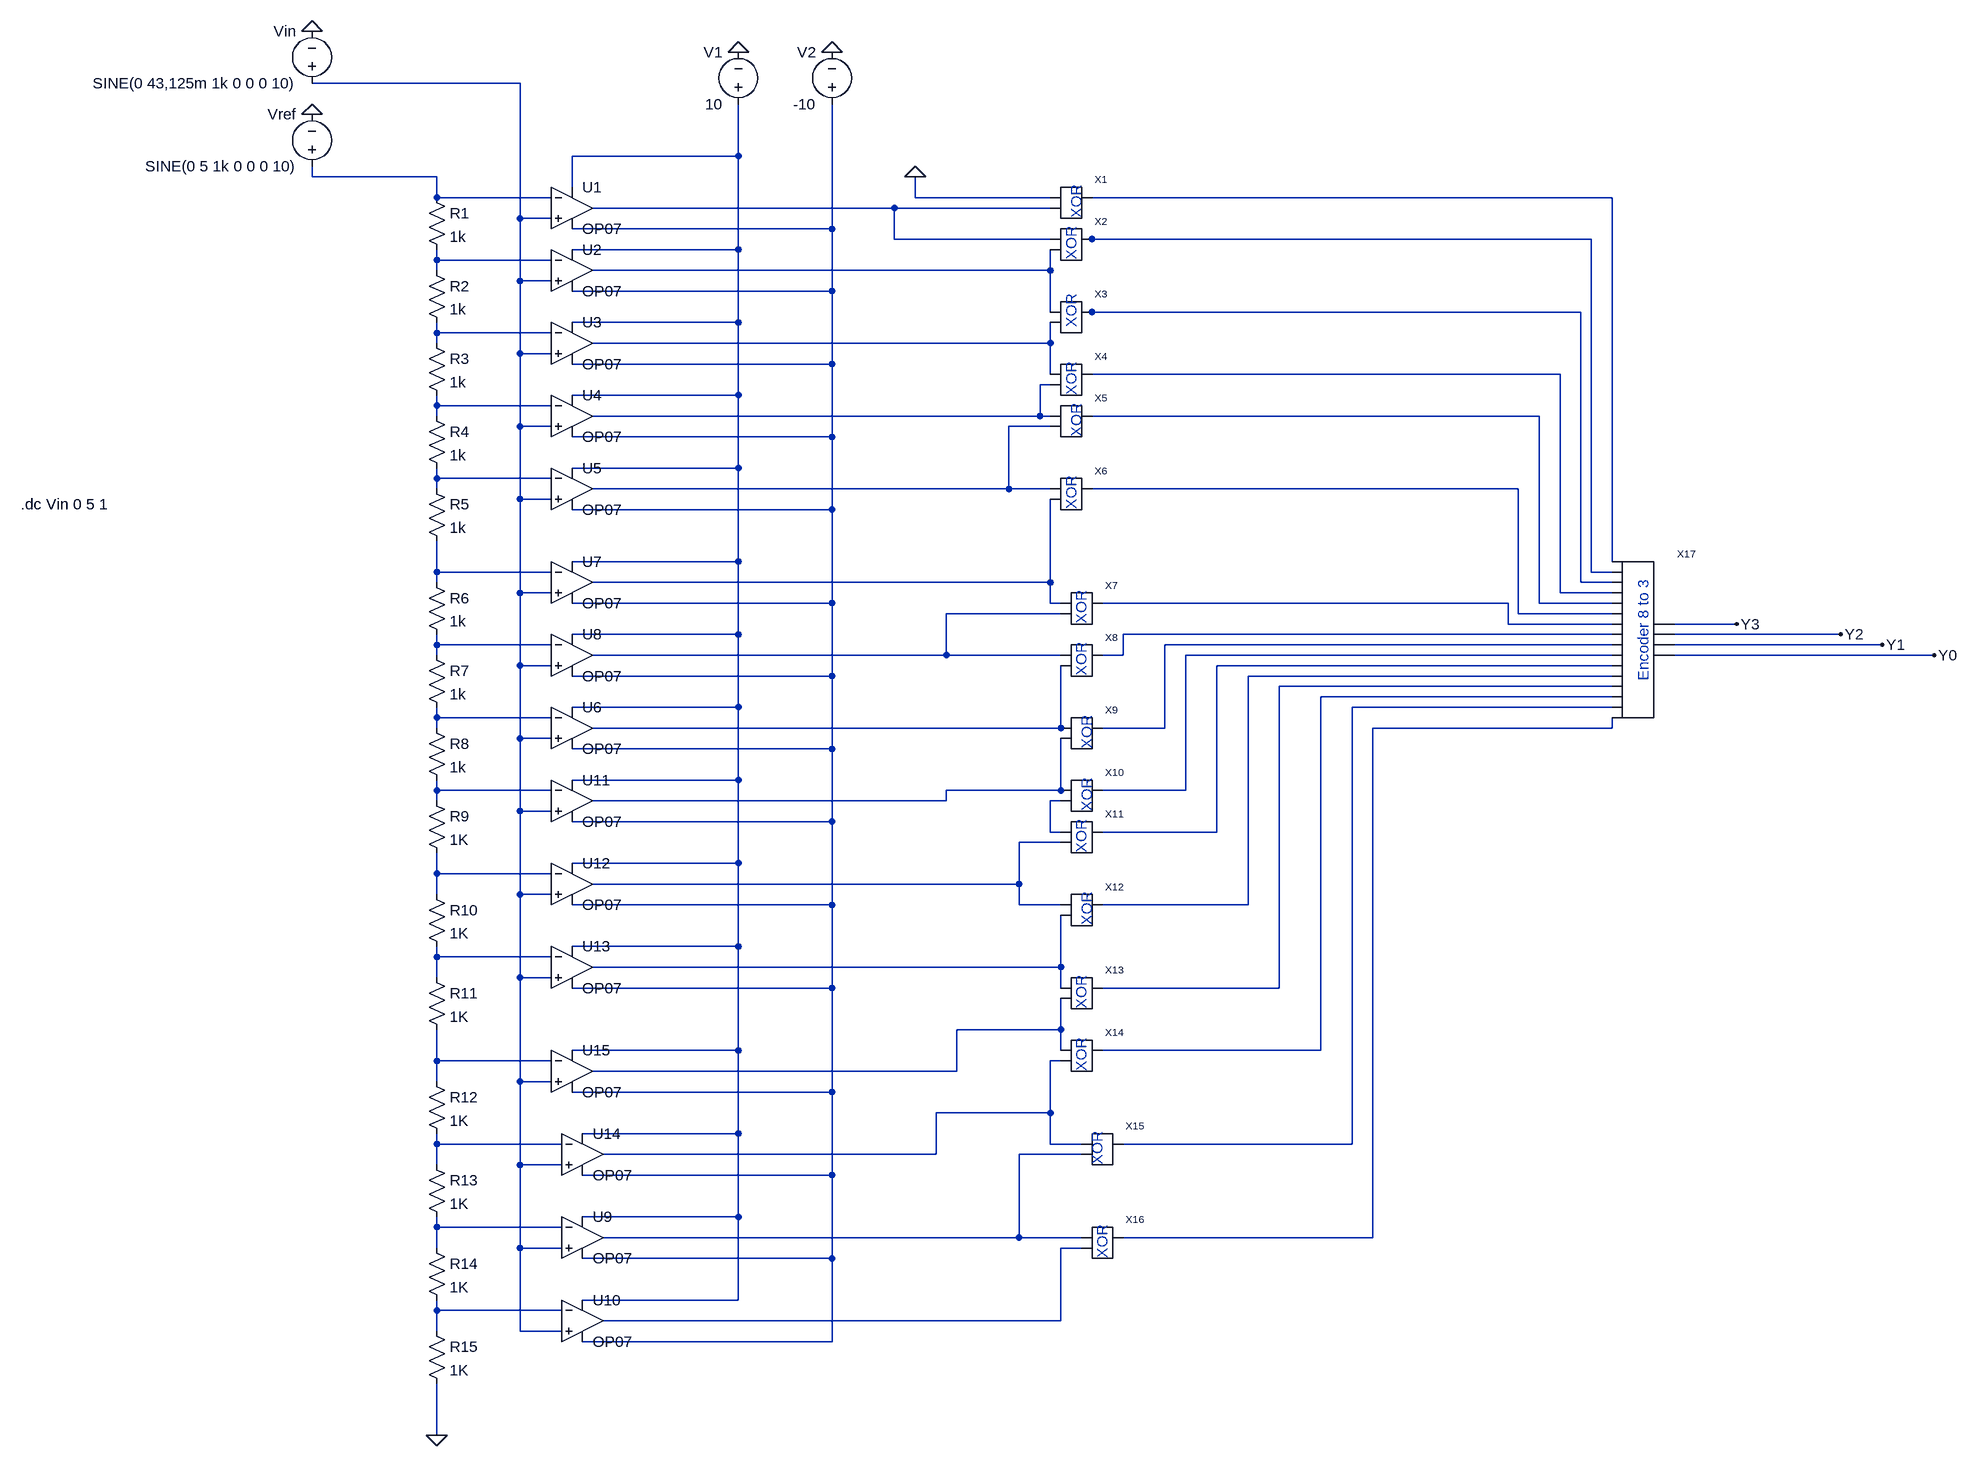
[diagram p0: schematic ADC.asc]
ADC.asc, the LTspice schematic file:
Version 4
SHEET 1 2248 2340
WIRE 0 -144 -320 -144
WIRE 336 -32 336 -112
WIRE 336 -32 80 -32
WIRE -320 0 -320 -16
WIRE -128 0 -320 0
WIRE 80 16 80 -32
WIRE -128 32 -128 0
WIRE 48 32 -128 32
WIRE 608 32 608 0
WIRE 816 32 608 32
WIRE 1680 32 880 32
WIRE 576 48 112 48
WIRE 816 48 576 48
WIRE 0 64 0 -144
WIRE 48 64 0 64
WIRE 480 80 480 -112
WIRE 480 80 80 80
WIRE 576 96 576 48
WIRE 816 96 576 96
WIRE 880 96 864 96
WIRE 1648 96 880 96
WIRE 336 112 336 -32
WIRE 336 112 80 112
WIRE -128 128 -128 112
WIRE 48 128 -128 128
WIRE -128 144 -128 128
WIRE 816 144 816 112
WIRE 816 144 112 144
WIRE 0 160 0 64
WIRE 48 160 0 160
WIRE 480 176 480 80
WIRE 480 176 80 176
WIRE 816 208 816 144
WIRE 880 208 864 208
WIRE 1632 208 880 208
WIRE 336 224 336 112
WIRE 336 224 80 224
WIRE -128 240 -128 224
WIRE 48 240 -128 240
WIRE -128 256 -128 240
WIRE 816 256 816 224
WIRE 816 256 112 256
WIRE 0 272 0 160
WIRE 48 272 0 272
WIRE 480 288 480 176
WIRE 480 288 80 288
WIRE 816 304 816 256
WIRE 1600 304 880 304
WIRE 816 320 800 320
WIRE 336 336 336 224
WIRE 336 336 80 336
WIRE -128 352 -128 336
WIRE 48 352 -128 352
WIRE -128 368 -128 352
WIRE 800 368 800 320
WIRE 800 368 112 368
WIRE 816 368 800 368
WIRE 1568 368 880 368
WIRE 0 384 0 272
WIRE 48 384 0 384
WIRE 816 384 752 384
WIRE 480 400 480 288
WIRE 480 400 80 400
WIRE 336 448 336 336
WIRE 336 448 80 448
WIRE -128 464 -128 448
WIRE 48 464 -128 464
WIRE -128 480 -128 464
WIRE 752 480 752 384
WIRE 752 480 112 480
WIRE 816 480 752 480
WIRE 1536 480 880 480
WIRE 0 496 0 384
WIRE 48 496 0 496
WIRE 480 512 480 400
WIRE 480 512 80 512
WIRE 336 592 336 448
WIRE 336 592 80 592
WIRE 1680 592 1680 32
WIRE -128 608 -128 560
WIRE 48 608 -128 608
WIRE 1648 608 1648 96
WIRE 1680 608 1648 608
WIRE -128 624 -128 608
WIRE 816 624 816 496
WIRE 816 624 112 624
WIRE 1632 624 1632 208
WIRE 1680 624 1632 624
WIRE 0 640 0 496
WIRE 48 640 0 640
WIRE 1600 640 1600 304
WIRE 1680 640 1600 640
WIRE 480 656 480 512
WIRE 480 656 80 656
WIRE 816 656 816 624
WIRE 832 656 816 656
WIRE 1520 656 896 656
WIRE 1568 656 1568 368
WIRE 1680 656 1568 656
WIRE 832 672 656 672
WIRE 1536 672 1536 480
WIRE 1680 672 1536 672
WIRE 1520 688 1520 656
WIRE 1680 688 1520 688
WIRE 1872 688 1776 688
WIRE 336 704 336 592
WIRE 336 704 80 704
WIRE 1680 704 928 704
WIRE 2032 704 1776 704
WIRE -128 720 -128 704
WIRE 48 720 -128 720
WIRE 1680 720 992 720
WIRE 2096 720 1776 720
WIRE -128 736 -128 720
WIRE 656 736 656 672
WIRE 656 736 112 736
WIRE 832 736 656 736
WIRE 928 736 928 704
WIRE 928 736 896 736
WIRE 1680 736 1024 736
WIRE 2176 736 1776 736
WIRE 0 752 0 640
WIRE 48 752 0 752
WIRE 1680 752 1072 752
WIRE 480 768 480 656
WIRE 480 768 80 768
WIRE 1680 768 1120 768
WIRE 1680 784 1168 784
WIRE 1680 800 1232 800
WIRE 336 816 336 704
WIRE 336 816 80 816
WIRE 1680 816 1280 816
WIRE -128 832 -128 816
WIRE 48 832 -128 832
WIRE -128 848 -128 832
WIRE 832 848 832 752
WIRE 832 848 112 848
WIRE 992 848 992 720
WIRE 992 848 896 848
WIRE 1680 848 1680 832
WIRE 1680 848 1312 848
WIRE 0 864 0 752
WIRE 48 864 0 864
WIRE 480 880 480 768
WIRE 480 880 80 880
WIRE 336 928 336 816
WIRE 336 928 80 928
WIRE -128 944 -128 928
WIRE 48 944 -128 944
WIRE 832 944 832 864
WIRE 832 944 656 944
WIRE 1024 944 1024 736
WIRE 1024 944 896 944
WIRE -128 960 -128 944
WIRE 656 960 656 944
WIRE 656 960 112 960
WIRE 832 960 816 960
WIRE 0 976 0 864
WIRE 48 976 0 976
WIRE 480 992 480 880
WIRE 480 992 80 992
WIRE 816 1008 816 960
WIRE 832 1008 816 1008
WIRE 1072 1008 1072 752
WIRE 1072 1008 896 1008
WIRE 832 1024 768 1024
WIRE 336 1056 336 928
WIRE 336 1056 80 1056
WIRE -128 1072 -128 1040
WIRE 48 1072 -128 1072
WIRE 768 1088 768 1024
WIRE 768 1088 112 1088
WIRE -128 1104 -128 1072
WIRE 0 1104 0 976
WIRE 48 1104 0 1104
WIRE 480 1120 480 992
WIRE 480 1120 80 1120
WIRE 768 1120 768 1088
WIRE 832 1120 768 1120
WIRE 1120 1120 1120 768
WIRE 1120 1120 896 1120
WIRE 336 1184 336 1056
WIRE 336 1184 80 1184
WIRE -128 1200 -128 1184
WIRE 48 1200 -128 1200
WIRE 832 1216 832 1136
WIRE 832 1216 112 1216
WIRE -128 1232 -128 1200
WIRE 0 1232 0 1104
WIRE 48 1232 0 1232
WIRE 480 1248 480 1120
WIRE 480 1248 80 1248
WIRE 832 1248 832 1216
WIRE 1168 1248 1168 784
WIRE 1168 1248 896 1248
WIRE 832 1312 832 1264
WIRE 832 1312 672 1312
WIRE 336 1344 336 1184
WIRE 336 1344 80 1344
WIRE 832 1344 832 1312
WIRE 1232 1344 1232 800
WIRE 1232 1344 896 1344
WIRE -128 1360 -128 1312
WIRE 48 1360 -128 1360
WIRE 832 1360 816 1360
WIRE 672 1376 672 1312
WIRE 672 1376 112 1376
WIRE -128 1392 -128 1360
WIRE 0 1392 0 1232
WIRE 48 1392 0 1392
WIRE 480 1408 480 1248
WIRE 480 1408 80 1408
WIRE 816 1440 816 1360
WIRE 816 1440 640 1440
WIRE 336 1472 336 1344
WIRE 336 1472 96 1472
WIRE -128 1488 -128 1472
WIRE 64 1488 -128 1488
WIRE 816 1488 816 1440
WIRE 864 1488 816 1488
WIRE 1280 1488 1280 816
WIRE 1280 1488 928 1488
WIRE 640 1504 640 1440
WIRE 640 1504 128 1504
WIRE 864 1504 768 1504
WIRE -128 1520 -128 1488
WIRE 0 1520 0 1392
WIRE 64 1520 0 1520
WIRE 480 1536 480 1408
WIRE 480 1536 96 1536
WIRE 336 1600 336 1472
WIRE 336 1600 96 1600
WIRE -128 1616 -128 1600
WIRE 64 1616 -128 1616
WIRE 768 1632 768 1504
WIRE 768 1632 128 1632
WIRE 864 1632 768 1632
WIRE 1312 1632 1312 848
WIRE 1312 1632 928 1632
WIRE -128 1648 -128 1616
WIRE 0 1648 0 1520
WIRE 64 1648 0 1648
WIRE 864 1648 832 1648
WIRE 480 1664 480 1536
WIRE 480 1664 96 1664
WIRE 336 1728 336 1600
WIRE 336 1728 96 1728
WIRE -128 1744 -128 1728
WIRE 64 1744 -128 1744
WIRE 832 1760 832 1648
WIRE 832 1760 128 1760
WIRE -128 1776 -128 1744
WIRE 0 1776 0 1648
WIRE 64 1776 0 1776
WIRE 480 1792 480 1664
WIRE 480 1792 96 1792
WIRE -128 1936 -128 1856
FLAG -128 1936 0
FLAG 336 -192 0
FLAG 480 -192 0
FLAG 608 0 0
FLAG -320 -224 0
FLAG -320 -96 0
FLAG 1872 688 Y3
FLAG 2032 704 Y2
FLAG 2176 736 Y0
FLAG 2096 720 Y1
SYMBOL OpAmps\\OP07 80 -16 R0
SYMATTR InstName U1
SYMBOL OpAmps\\OP07 80 80 R0
SYMATTR InstName U2
SYMBOL OpAmps\\OP07 80 192 R0
SYMATTR InstName U3
SYMBOL OpAmps\\OP07 80 304 R0
SYMATTR InstName U4
SYMBOL OpAmps\\OP07 80 416 R0
SYMATTR InstName U5
SYMBOL OpAmps\\OP07 80 784 R0
SYMATTR InstName U6
SYMBOL OpAmps\\OP07 80 560 R0
SYMATTR InstName U7
SYMBOL OpAmps\\OP07 80 672 R0
SYMATTR InstName U8
SYMBOL OpAmps\\OP07 96 1568 R0
SYMATTR InstName U9
SYMBOL OpAmps\\OP07 96 1696 R0
SYMATTR InstName U10
SYMBOL OpAmps\\OP07 80 896 R0
SYMATTR InstName U11
SYMBOL OpAmps\\OP07 80 1024 R0
SYMATTR InstName U12
SYMBOL OpAmps\\OP07 80 1152 R0
SYMATTR InstName U13
SYMBOL OpAmps\\OP07 96 1440 R0
SYMATTR InstName U14
SYMBOL OpAmps\\OP07 80 1312 R0
SYMATTR InstName U15
SYMBOL res -144 16 R0
SYMATTR InstName R1
SYMATTR Value 1k
SYMBOL res -144 128 R0
SYMATTR InstName R2
SYMATTR Value 1k
SYMBOL res -144 240 R0
SYMATTR InstName R3
SYMATTR Value 1k
SYMBOL res -144 352 R0
SYMATTR InstName R4
SYMATTR Value 1k
SYMBOL res -144 464 R0
SYMATTR InstName R5
SYMATTR Value 1k
SYMBOL res -144 608 R0
SYMATTR InstName R6
SYMATTR Value 1k
SYMBOL res -144 720 R0
SYMATTR InstName R7
SYMATTR Value 1k
SYMBOL res -144 832 R0
SYMATTR InstName R8
SYMATTR Value 1k
SYMBOL res -144 944 R0
SYMATTR InstName R9
SYMATTR Value 1K
SYMBOL res -144 1088 R0
SYMATTR InstName R10
SYMATTR Value 1K
SYMBOL res -144 1216 R0
SYMATTR InstName R11
SYMATTR Value 1K
SYMBOL res -144 1376 R0
SYMATTR InstName R12
SYMATTR Value 1K
SYMBOL res -144 1504 R0
SYMATTR InstName R13
SYMATTR Value 1K
SYMBOL res -144 1632 R0
SYMATTR InstName R14
SYMATTR Value 1K
SYMBOL res -144 1760 R0
SYMATTR InstName R15
SYMATTR Value 1K
SYMBOL voltage 336 -96 R180
WINDOW 0 24 96 Left 2
WINDOW 3 24 16 Left 2
SYMATTR InstName V1
SYMATTR Value 10
SYMBOL voltage 480 -96 R180
WINDOW 0 24 96 Left 2
WINDOW 3 24 16 Left 2
SYMATTR InstName V2
SYMATTR Value -10
SYMBOL XOR2 928 80 R0
SYMATTR InstName X1
SYMBOL XOR2 928 144 R0
SYMATTR InstName X2
SYMBOL XOR2 928 256 R0
SYMATTR InstName X3
SYMBOL XOR2 928 352 R0
SYMATTR InstName X4
SYMBOL XOR2 928 416 R0
SYMATTR InstName X5
SYMBOL XOR2 928 528 R0
SYMATTR InstName X6
SYMBOL XOR2 944 704 R0
SYMATTR InstName X7
SYMBOL XOR2 944 784 R0
SYMATTR InstName X8
SYMBOL XOR2 944 896 R0
SYMATTR InstName X9
SYMBOL XOR2 944 992 R0
SYMATTR InstName X10
SYMBOL XOR2 944 1056 R0
SYMATTR InstName X11
SYMBOL XOR2 944 1168 R0
SYMATTR InstName X12
SYMBOL XOR2 944 1296 R0
SYMATTR InstName X13
SYMBOL XOR2 944 1392 R0
SYMATTR InstName X14
SYMBOL XOR2 976 1536 R0
SYMATTR InstName X15
SYMBOL XOR2 976 1680 R0
SYMATTR InstName X16
SYMBOL Encod16-4 1776 736 R0
SYMATTR InstName X17
SYMBOL voltage -320 -128 R180
WINDOW 0 24 96 Left 2
WINDOW 3 24 16 Left 2
WINDOW 123 0 0 Left 0
WINDOW 39 0 0 Left 0
SYMATTR InstName Vin
SYMATTR Value SINE(0 43,125m 1k 0 0 0 10)
SYMBOL voltage -320 0 R180
WINDOW 0 24 96 Left 2
WINDOW 3 24 16 Left 2
WINDOW 123 0 0 Left 0
WINDOW 39 0 0 Left 0
SYMATTR InstName Vref
SYMATTR Value SINE(0 5 1k 0 0 0 10)
TEXT 1728 776 VLeft 2 ;Encoder 8 to 3
TEXT 856 64 VLeft 2 ;XOR
TEXT 848 128 VLeft 2 ;XOR
TEXT 848 232 VLeft 2 ;XOR
TEXT 848 336 VLeft 2 ;XOR
TEXT 856 400 VLeft 2 ;XOR
TEXT 848 512 VLeft 2 ;XOR
TEXT 864 688 VLeft 2 ;XOR
TEXT 864 768 VLeft 2 ;XOR
TEXT 872 880 VLeft 2 ;XOR
TEXT 872 976 VLeft 2 ;XOR
TEXT 864 1040 VLeft 2 ;XOR
TEXT 872 1152 VLeft 2 ;XOR
TEXT 864 1280 VLeft 2 ;XOR
TEXT 864 1376 VLeft 2 ;XOR
TEXT 888 1520 VLeft 2 ;XOR
TEXT 896 1664 VLeft 2 ;XOR
TEXT -768 504 Left 2 !.dc Vin 0 5 1

The netlist it stands for:
* ADC.asc
XU1 N001 N003 N002 N006 N005 LT1001  ; OP07, pins In+ In- V+ V- OUT
XU2 N001 N008 N002 N006 N009 LT1001  ; OP07, pins In+ In- V+ V- OUT
XU3 N001 N011 N002 N006 N012 LT1001  ; OP07, pins In+ In- V+ V- OUT
XU4 N001 N015 N002 N006 N014 LT1001  ; OP07, pins In+ In- V+ V- OUT
XU5 N001 N018 N002 N006 N017 LT1001  ; OP07, pins In+ In- V+ V- OUT
XU6 N001 N033 N002 N006 N034 LT1001  ; OP07, pins In+ In- V+ V- OUT
XU7 N001 N020 N002 N006 N021 LT1001  ; OP07, pins In+ In- V+ V- OUT
XU8 N001 N025 N002 N006 N023 LT1001  ; OP07, pins In+ In- V+ V- OUT
XU9 N001 N048 N002 N006 N047 LT1001  ; OP07, pins In+ In- V+ V- OUT
XU10 N001 N050 N002 N006 N049 LT1001  ; OP07, pins In+ In- V+ V- OUT
XU11 N001 N036 N002 N006 N037 LT1001  ; OP07, pins In+ In- V+ V- OUT
XU12 N001 N040 N002 N006 N039 LT1001  ; OP07, pins In+ In- V+ V- OUT
XU13 N001 N041 N002 N006 N042 LT1001  ; OP07, pins In+ In- V+ V- OUT
XU14 N001 N046 N002 N006 N045 LT1001  ; OP07, pins In+ In- V+ V- OUT
XU15 N001 N044 N002 N006 N043 LT1001  ; OP07, pins In+ In- V+ V- OUT
R1 N003 N008 1k
R2 N008 N011 1k
R3 N011 N015 1k
R4 N015 N018 1k
R5 N018 N020 1k
R6 N020 N025 1k
R7 N025 N033 1k
R8 N033 N036 1k
R9 N036 N040 1K
R10 N040 N041 1K
R11 N041 N044 1K
R12 N044 N046 1K
R13 N046 N048 1K
R14 N048 N050 1K
R15 N050 0 1K
V1 N002 0 10
V2 N006 0 -10
XX1 0 N005 N004 XOR2  ; pins A B Y
XX2 N005 N009 N007 XOR2  ; pins A B Y
XX3 N009 N012 N010 XOR2  ; pins A B Y
XX4 N012 N014 N013 XOR2  ; pins A B Y
XX5 N014 N017 N016 XOR2  ; pins A B Y
XX6 N017 N021 N019 XOR2  ; pins A B Y
XX7 N021 N023 N022 XOR2  ; pins A B Y
XX8 N023 N034 N024 XOR2  ; pins A B Y
XX9 N034 N037 N026 XOR2  ; pins A B Y
XX10 N037 N038 N027 XOR2  ; pins A B Y
XX11 N038 N039 N028 XOR2  ; pins A B Y
XX12 N039 N042 N029 XOR2  ; pins A B Y
XX13 N042 N043 N030 XOR2  ; pins A B Y
XX14 N043 N045 N031 XOR2  ; pins A B Y
XX15 N045 N047 N032 XOR2  ; pins A B Y
XX16 N047 N049 N035 XOR2  ; pins A B Y
XX17 N004 N007 N010 N013 N016 N019 N022 N024 N026 N027 N028 N029 N030 N031 N032 N035 Y3 Y2 Y1 Y0 Encod16-4  ; pins A15 A14 A13 A12 A11 A10 A9 A8 A7 A6 A5 A4 A3 A2 A1 A0 Y3 Y2 Y1 Y0
Vin N001 0 SINE(0 43,125m 1k 0 0 0 10)
Vref N003 0 SINE(0 5 1k 0 0 0 10)
* Encoder 8 to 3
* XOR
* XOR
* XOR
* XOR
* XOR
* XOR
* XOR
* XOR
* XOR
* XOR
* XOR
* XOR
* XOR
* XOR
* XOR
* XOR
.dc Vin 0 5 1
.lib LTC.lib
.backanno
.end